# EAGLE design SparkFun_MOSFET_Power_Controller (EAGLE 6.3)
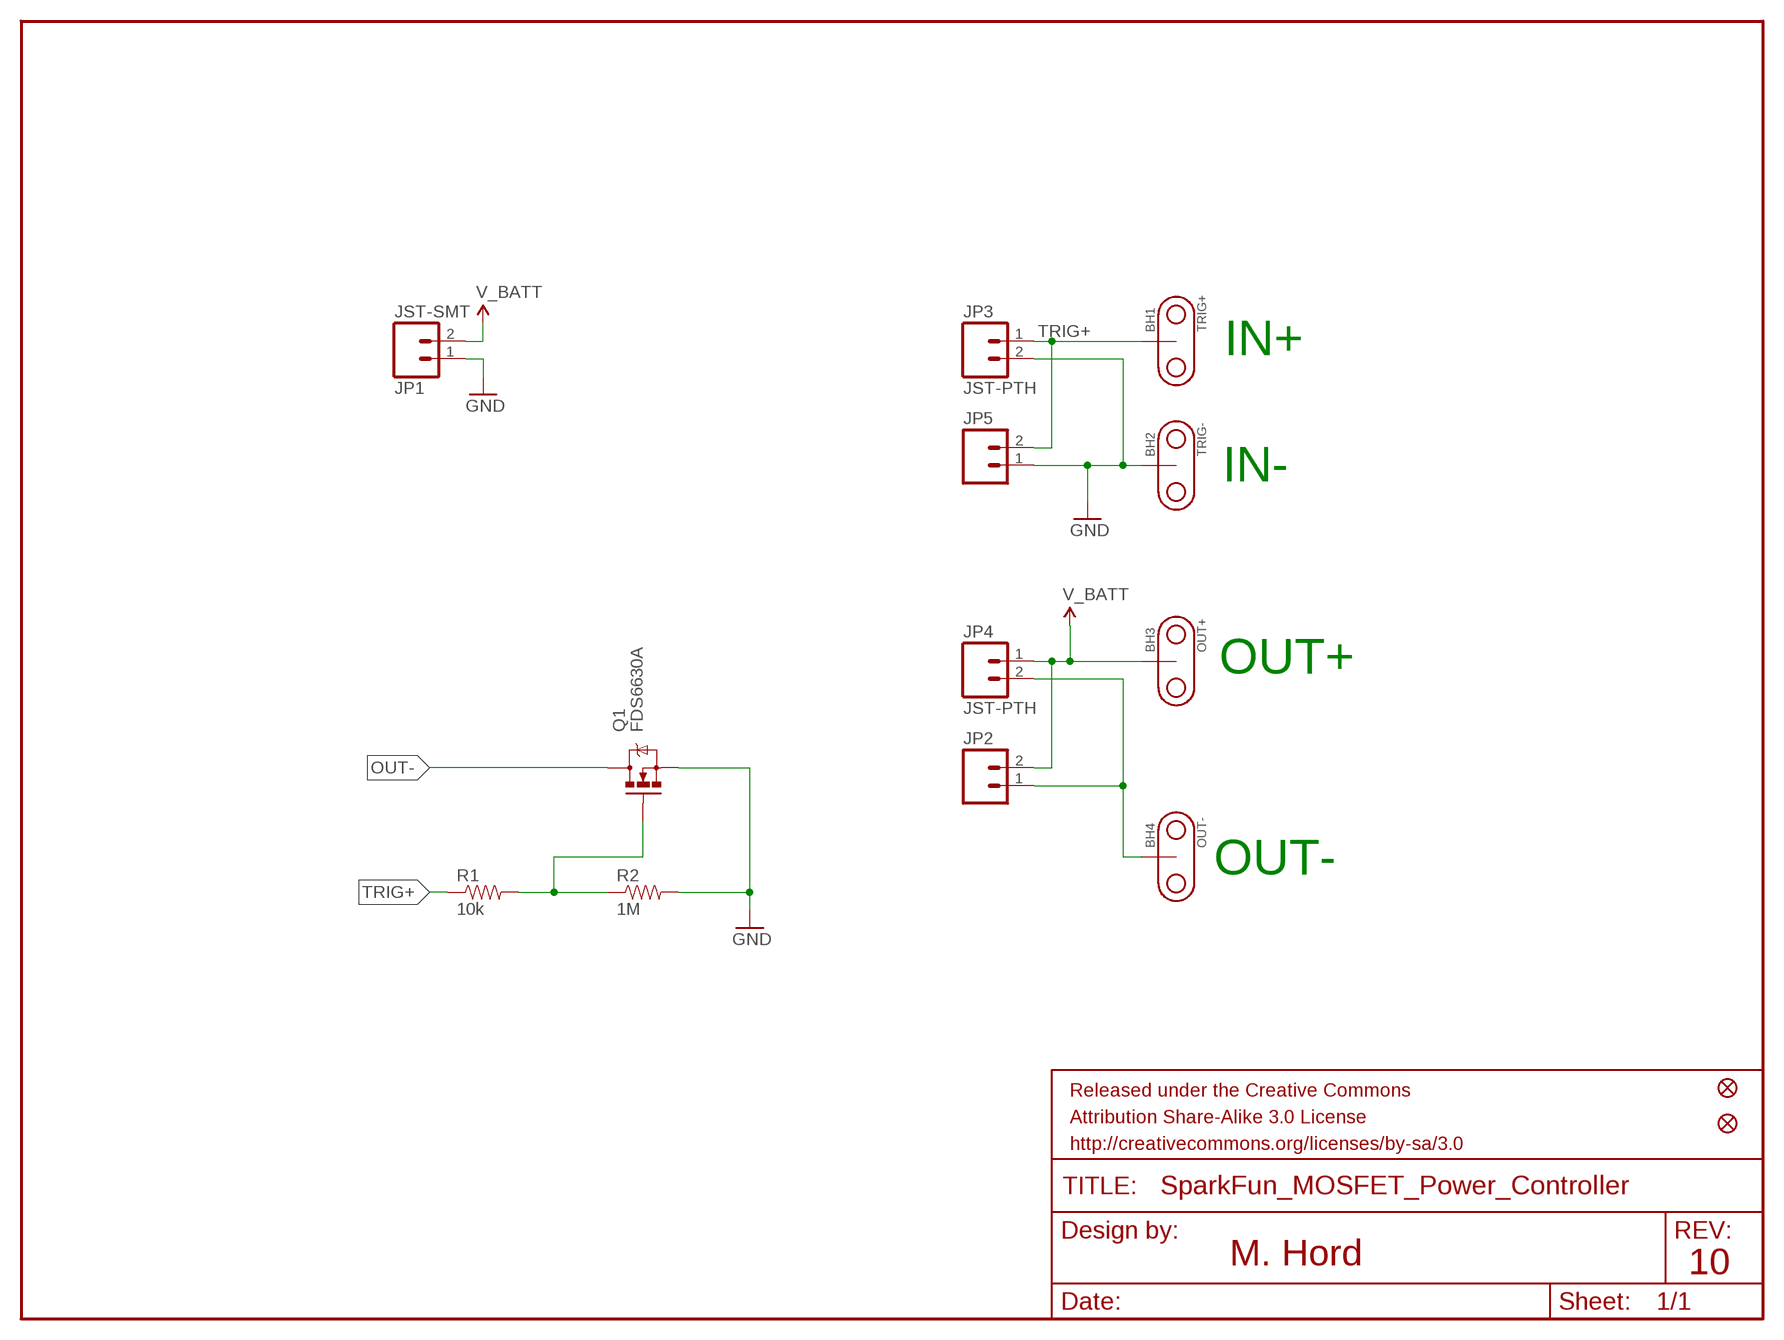
[diagram p0: schematic, sheet 1]

## Parts
BH1  TRIG+  BUTTONHOLELARGE  [BUTTONHOLE]
BH2  TRIG-  BUTTONHOLELARGE  [BUTTONHOLE]
BH3  OUT+  BUTTONHOLELARGE  [BUTTONHOLE]
BH4  OUT-  BUTTONHOLELARGE  [BUTTONHOLE]
FRAME1  FRAME-LETTER  [CREATIVE_COMMONS]
JP1  JST-SMT  M02-JST-2MM-SMT  [JST-2-SMD]
JP2  M02PTH  [1X02]
JP3  JST-PTH  M02-JST-2-PTH-NO_SILK  [JST-2-PTH-NS]
JP4  JST-PTH  M02-JST-2-PTH-NO_SILK  [JST-2-PTH-NS]
JP5  M02PTH  [1X02]
JP6  FIDUCIALUFIDUCIAL  [MICRO-FIDUCIAL]
JP7  FIDUCIALUFIDUCIAL  [MICRO-FIDUCIAL]
Q1  FDS6630A  MOSFET-NCHANNELFDS6630A  [SO08]
R1  10k  RESISTOR0402-RES  [0402-RES]
R2  1M  1M-1%  [0402-RES]

## Nets
GND: BH2.P$1 JP1.1 JP3.2 JP5.1 Q1.1(S) Q1.2(S) Q1.3(S) R2.2
N$1: Q1.4(G) R1.2 R2.1
OUT-: BH4.P$1 JP2.1 JP4.2 Q1.5(D) Q1.6(D) Q1.7(D) Q1.8(D)
TRIG+: BH1.P$1 JP3.1 JP5.2 R1.1
V_BATT: BH3.P$1 JP1.2 JP2.2 JP4.1

## Notes on the sheet
- IN+
- IN-
- OUT+
- OUT-
- M. Hord | 10

## Library data of the parts
BH1-BH4 = LilyPad-Wearables:BUTTONHOLE; NO_PART: 1
FRAME1 = SparkFun-Aesthetics:FRAME-LETTER: Schematic Frame Standard 8.5x11 US Letter frame
JP1 = SparkFun-Connectors:M02: Header 2 Standard 2-pin 0.1" header. Use with straight break away headers (SKU : PRT-00116), right angle break away headers (PRT-00553), swiss pins (PRT-00743), machine pins (PRT-00117), and female headers (PRT-00115). Molex polarized connector foot print use with SKU : PRT-08233 with associated crimp pins and housings.; PROD_ID: CONN-08352
JP2 JP5 = SparkFun-Connectors:M02: Header 2 Standard 2-pin 0.1" header. Use with straight break away headers (SKU : PRT-00116), right angle break away headers (PRT-00553), swiss pins (PRT-00743), machine pins (PRT-00117), and female headers (PRT-00115). Molex polarized connector foot print use with SKU : PRT-08233 with associated crimp pins and housings.
JP3 JP4 = SparkFun-Connectors:M02: Header 2 Standard 2-pin 0.1" header. Use with straight break away headers (SKU : PRT-00116), right angle break away headers (PRT-00553), swiss pins (PRT-00743), machine pins (PRT-00117), and female headers (PRT-00115). Molex polarized connector foot print use with SKU : PRT-08233 with associated crimp pins and housings.; NO_PART: 1
JP6 JP7 = SparkFun:FIDUCIAL: Fiducial Alignment Points Various fiducial points for machine vision alignment.
Q1 = SparkFun-DiscreteSemi:MOSFET-NCHANNEL: Common NMOSFET Parts MFG P/N Store ID Prod ID FDD8780 TRANS-09984 SI7820DN TRANS-11055 FDS6630A IC-08089 2N7002PW TRANS-11151 FQP30N06L COM-10213 TRANS-10060 BSS123LT1G TRANS-08345 BSS138 TRANS-00830 BS170 2N7000; PROD_ID: IC-08089
R1 = SparkFun-Passives:RESISTOR: Resistor Basic schematic elements and footprints for 0603, 1206, and PTH resistors.; PROD_ID: RES-00824
R2 = SparkFun-Resistors:1M-1%: 1M-ohm SMT 1/10W - 1% (0603) RES-07868; PROD_ID: RES-07868

## Board
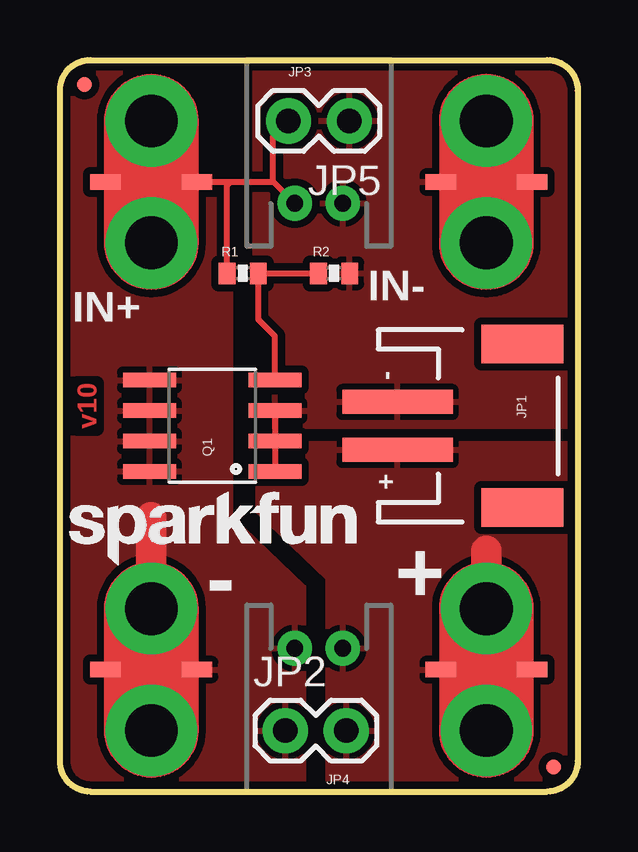
[diagram p1: board, top side]
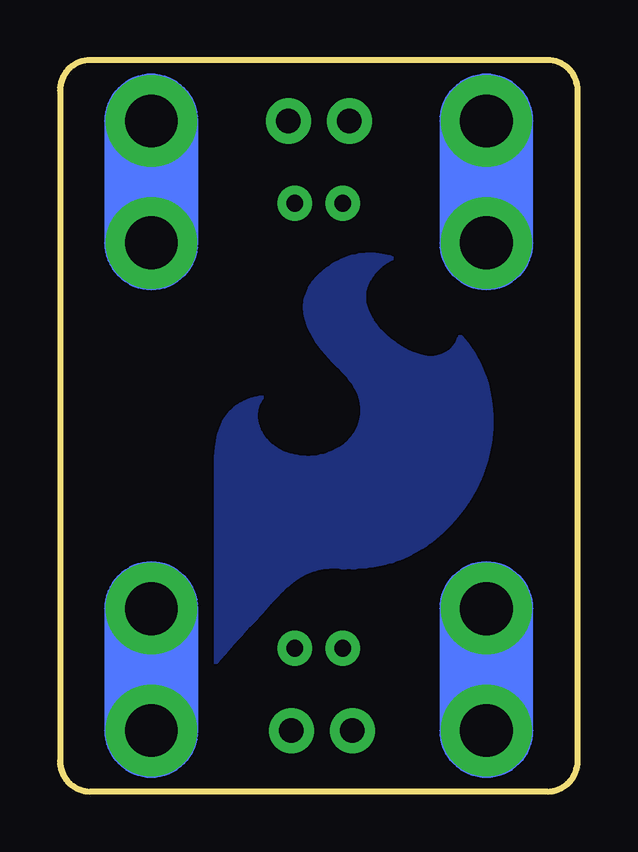
[diagram p2: board, bottom side, seen from below]

Size 21.59 x 30.48 mm. Coordinates in mm from the lower left corner, seen from the top.
Outline: 1.27,0 20.32,0 arc90 21.59,1.27 21.59,29.21 arc90 20.32,30.48 1.27,30.48 arc90 0,29.21 0,1.27 arc90 1.27,0
Copper layers (1*16): Top 0.035mm / dielectric 1.5mm / Bottom 0.035mm
Design rules "default": minimum track width 8mil, minimum drill 20mil, track to track 8mil, track to pad 8mil, pad to pad 8mil, via to via 8mil, smd to smd 8mil, copper to edge 8mil, drill to drill 8mil, minimum pad ring 12mil, minimum via ring 10mil, stop-mask expansion 4mil, vias tented up to drill 20mil, thermal gap 10mil
bRestrict: area 0,-0.1 to 16.5,30.4; area 5.1,-0.1 to 21.6,30.4

### Footprints (pad centres in the part's own frame; a part is rotated, then mirrored left to right if it is on the bottom)
BUTTONHOLE = drill 2.2 pad 3.81: 1 0,0; P$2 5.08,0 | smd 0.635 x 1.27: P$1 2.54,1.905; P$3 2.54,-1.905
JST-2-SMD = smd 1 x 4.6: 1 -1,-3.7; 2 1,-3.7 | smd 1.6 x 3.4: NC1 -3.4,1.5; NC2 3.4,1.5
1X02 = drill 1.016 pad 1.88: 1 0,0; 2 2.54,0
JST-2-PTH-NS = drill 0.7 pad 1.448: 1 -1,0; 2 1,0
MICRO-FIDUCIAL = smd 0.635 x 0.635: 1 0,0
SO08 = smd 0.61 x 2.21: 1 -1.905,-2.616; 2 -0.635,-2.616; 3 0.635,-2.616; 4 1.905,-2.616; 5 1.905,2.616; 6 0.635,2.616; 7 -0.635,2.616; 8 -1.905,2.616
0402-RES = smd 0.7 x 0.9: 1 -0.65,0; 2 0.65,0

### Placement (x,y rotation side)
BH1  3.81,27.94 270 top
BH2  17.78,22.86 90 top
BH3  17.78,2.54 90 top
BH4  3.81,7.62 270 top
FRAME1  -53.34,-12.7 0 top  (outside the outline)
JP1  17.78,15.24 270 top
JP2  9.4,2.54 0 top
JP3  10.79,24.51 0 top
JP4  10.79,5.97 180 top
JP5  12.06,27.94 180 top
JP6  20.57,1.02 0 top
JP7  1.02,29.46 0 top
Q1  6.35,15.24 90 top
R1  7.62,21.59 0 top
R2  11.43,21.59 0 top

### Tracks (layer width: path | path; a pad name or v marks a point on that pad's centre or on a via)
GND
  Top 0.254: Q1.3 Q1.2 Q1.1
  pour Top (isolate 0.305): 8.13,30.48 8.13,15.24 21.59,15.24 21.59,30.48
N$1
  Top 0.254: R2.1 R1.2 8.27,19.67 8.97,18.97 Q1.4
N$2
  pour Bottom (isolate 0.305): 0,30.48 21.59,30.48 21.59,0 0,0
OUT-
  Top 1.27: 3.81,11.43 3.81,7.62
  pour Top (isolate 0.305): 7.11,11.43 7.11,30.48 0,30.48 0,0 10.16,0 10.16,8.51
TRIG+
  Top 0.254: 8.89,25.4 JP3.1 | BH1.P$1 7.11,25.4 | 7.11,25.4 8.89,25.4 | R1.1 6.97,25.26 7.11,25.4 | 8.89,25.4 8.89,27.3 JP5.2
V_BATT
  Top 1.27: 17.78,10.03 17.78,7.62
  pour Top (isolate 0.305): 8.26,14.48 8.26,11.68 11.18,8.89 11.18,0 21.59,0 21.59,14.48

### Text on the board
Top: v10
tPlace: IN+ | IN- | - | + | - | +
tNames: M.Hord